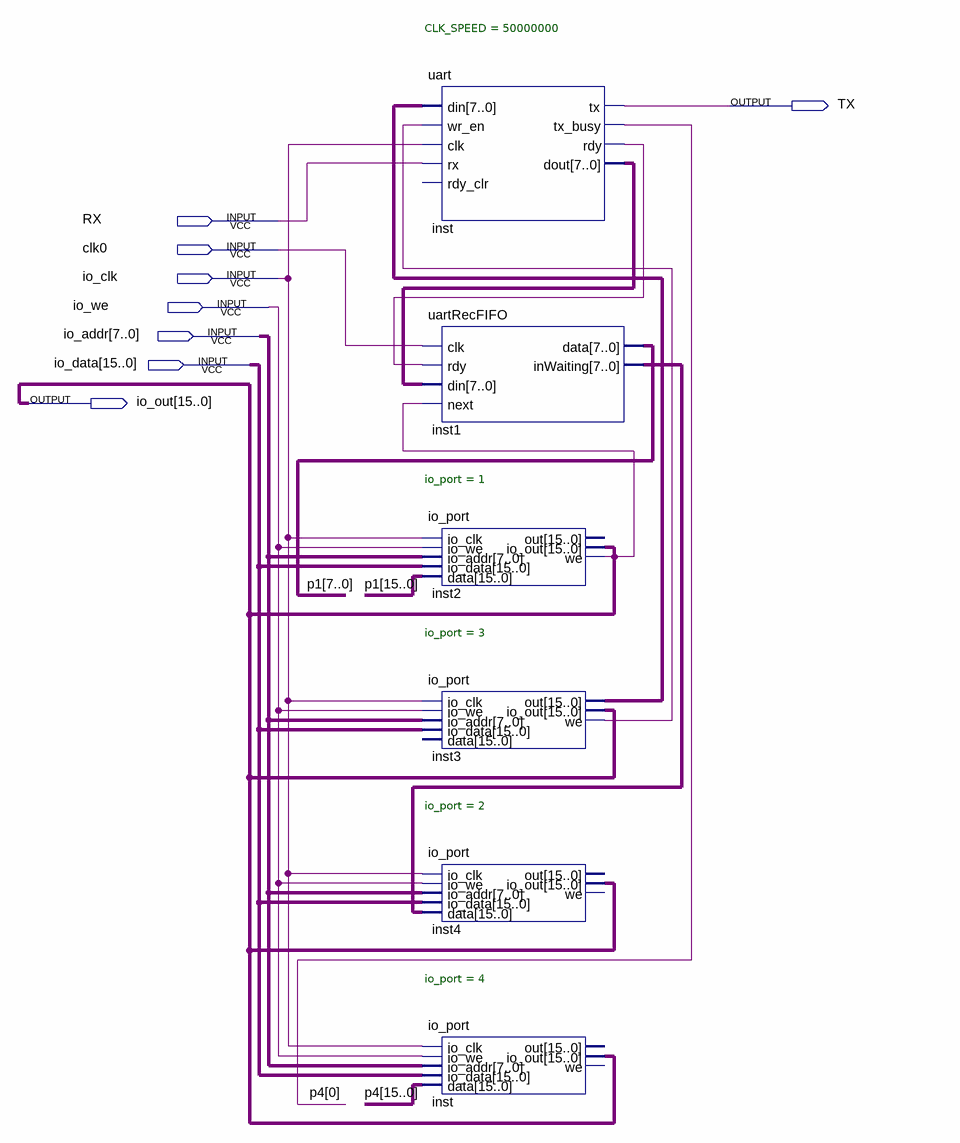
[diagram p0: schematic sheet]
// Quartus schematic uart.bdf as structural Verilog: 6 symbols, 8 pins
module uart (
  input  RX,
  input  clk0,
  input  io_clk,
  input  io_we,
  input  [7:0] io_addr,
  input  [15:0] io_data,
  output TX,
  output [15:0] io_out
);

  wire inst2_we, inst3_we, inst_rdy;
  wire [7:0] inst_dout;
  wire [15:0] inst1_inwaiting, inst3_out, p1, p4;

  uart #(.CLK_SPEED(50000000)) inst (
    .din(inst3_out), .wr_en(inst3_we), .clk(io_clk), .rx(RX), .tx(TX), .tx_busy(p4[0]), .rdy(inst_rdy),
    .dout(inst_dout));  // open: rdy_clr
  uartRecFIFO inst1 (
    .clk(clk0), .rdy(inst_rdy), .din(inst_dout), .next(inst2_we), .data(p1[7:0]), .inWaiting(inst1_inwaiting));
  io_port #(.io_port(1)) inst2 (
    .io_clk(io_clk), .io_we(io_we), .io_addr(io_addr), .io_data(io_data), .data(p1), .io_out(io_out),
    .we(inst2_we));  // open: out
  io_port #(.io_port(3)) inst3 (
    .io_clk(io_clk), .io_we(io_we), .io_addr(io_addr), .io_data(io_data), .out(inst3_out), .io_out(io_out),
    .we(inst3_we));  // open: data
  io_port #(.io_port(2)) inst4 (
    .io_clk(io_clk), .io_we(io_we), .io_addr(io_addr), .io_data(io_data), .data(inst1_inwaiting),
    .io_out(io_out));  // open: out, we
  io_port #(.io_port(4)) inst_dup2 (
    .io_clk(io_clk), .io_we(io_we), .io_addr(io_addr), .io_data(io_data), .data(p4), .io_out(io_out));  // open: out, we
endmodule
